# Altium project 一体机V5.PrjPcb (part 3 of 4)

## Sheet 02-GPRS.SchDoc
size A4; DocumentNumber: 18; SheetNumber: 18; SheetTotal: 34
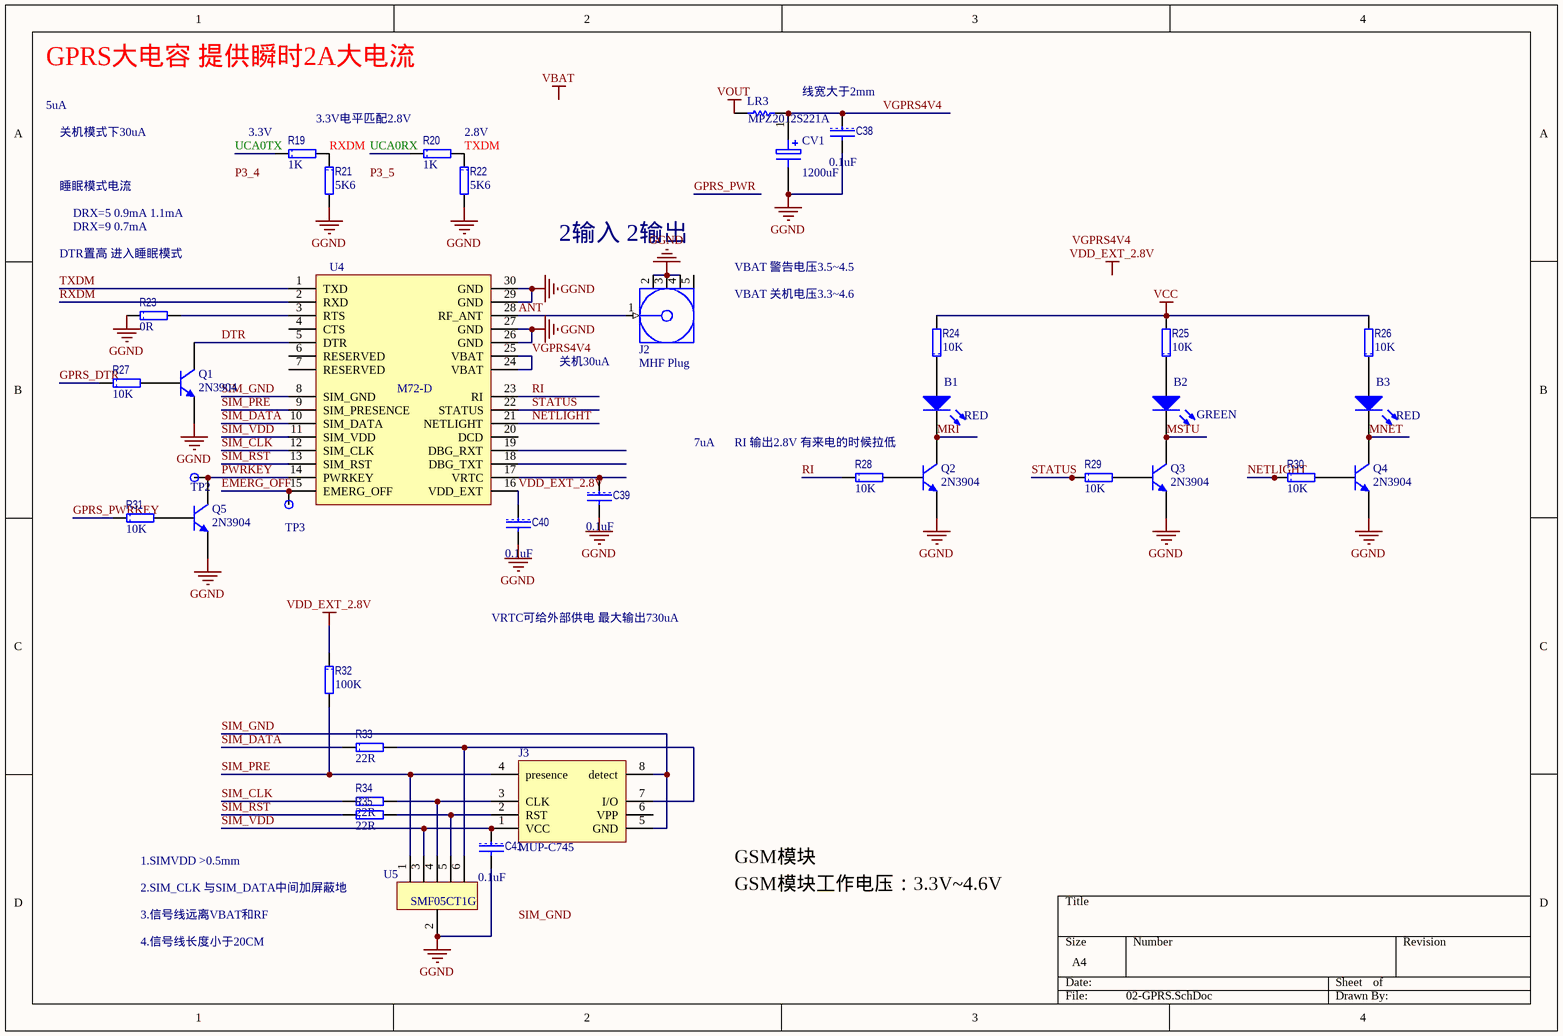
[diagram p18: 02-GPRS.SchDoc]

### Parts
B1  RED  [0805LED]
B2  GREEN  [0805LED]
B3  RED  [0805LED]
C38  value 0.1uF  [1608[0603]C]  (hidden comment: C1608X7R1H104K)
C39  value 0.1uF  [1608[0603]C]  (hidden comment: C1608X7R1H104K)
C40  value 0.1uF  [1608[0603]C]  (hidden comment: C1608X7R1H104K)
C41  value 0.1uF  [1608[0603]C]  (hidden comment: C1608X7R1H104K)
CV1  value 1200uF  [CAPPR5-10x20/H1.1]  (hidden comment: EEUFC1A122)
J2  MHF Plug  [MHF[MCB3]-V4]
J3  MUP-C745  [MUP-C745]
LR3  MPZ2012S221A  [2012[0805]]
Q1  2N3904  [SOT23_N]
Q2  2N3904  [SOT23_N]
Q3  2N3904  [SOT23_N]
Q4  2N3904  [SOT23_N]
Q5  2N3904  [SOT23_N]
R19  value 1K  [1608[0603]R]  (hidden comment: CRCW06031K00FKEA)
R20  value 1K  [1608[0603]R]  (hidden comment: CRCW06031K00FKEA)
R21  value 5K6  [1608[0603]R]  (hidden comment: CRCW060310K0FKEA)
R22  value 5K6  [1608[0603]R]  (hidden comment: CRCW060310K0FKEA)
R23  value 0R  [1608[0603]R]  (hidden comment: CRCW06030000ZSTA)
R24  value 10K  [1608[0603]R]  (hidden comment: CRCW060310K0FKEA)
R25  value 10K  [1608[0603]R]  (hidden comment: CRCW060310K0FKEA)
R26  value 10K  [1608[0603]R]  (hidden comment: CRCW060310K0FKEA)
R27  value 10K  [1608[0603]R]  (hidden comment: CRCW060310K0FKEA)
R28  value 10K  [1608[0603]R]  (hidden comment: CRCW060310K0FKEA)
R29  value 10K  [1608[0603]R]  (hidden comment: CRCW060310K0FKEA)
R30  value 10K  [1608[0603]R]  (hidden comment: CRCW060310K0FKEA)
R31  value 10K  [1608[0603]R]  (hidden comment: CRCW060310K0FKEA)
R32  value 100K  [1608[0603]R]  (hidden comment: CRCW0603100KFKEA)
R33  value 22R  [1608[0603]R]  (hidden comment: CRCW060322R0FKEA)
R34  value 22R  [1608[0603]R]  (hidden comment: CRCW060322R0FKEA)
R35  value 22R  [1608[0603]R]  (hidden comment: CRCW060322R0FKEA)
TP2  TP  [TP]  (value not drawn)
TP3  TP  [TP]  (value not drawn)
U4  M72-D  [M72D]
U5  SMF05CT1G  [SOT363-6N]

### Nets
GGND: C38.2 C39.2 C40.2 C41.2 CV1.2 J2.2(GND) J2.3(GND) J2.4(GND) Q1.1(E) Q2.1(E) Q3.1(E) Q4.1(E) Q5.1(E) R21.2 R22.2 R23.1 U4.26(GND) U4.27(GND) U4.29(GND) U4.30(GND) U5.2
VCC: R24.2 R25.2 R26.2
VDD_EXT_2.8V: C40.1 R32.1 U4.16(VDD_EXT)
VOUT: LR3.1
ANT: J2.1(Signal) U4.28(RF_ANT)
DTR: Q1.3(C) U4.5(DTR)
EMERG_OFF: TP3.1(TestPoint) U4.15(EMERG_OFF)
GPRS_DTR: R27.1
GPRS_PWRKEY: R31.1
MNET: B3.2(K) Q4.3(C)
MRI: B1.2(K) Q2.3(C)
MSTU: B2.2(K) Q3.3(C)
NETLIGHT: R30.1 U4.21(NETLIGHT)
PWRKEY: Q5.3(C) TP2.1(TestPoint) U4.14(PWRKEY)
RI: R28.1 U4.23(RI)
RXDM: R19.2 R21.1 U4.2(RXD)
SIM_CLK: R34.1 U4.12(SIM_CLK)
SIM_DATA: R33.1 U4.10(SIM_DATA)
SIM_GND: J3.5(GND) J3.8(detect) U4.8(SIM_GND)
SIM_PRE: J3.4(presence) R32.2 U4.9(SIM_PRESENCE) U5.1
SIM_RST: R35.1 U4.13(SIM_RST)
SIM_VDD: C41.1 J3.1(VCC) U4.11(SIM_VDD) U5.3
STATUS: R29.1 U4.22(STATUS)
TXDM: R20.2 R22.1 U4.1(TXD)
UCA0RX: R20.1  [project net P3_5]
UCA0TX: R19.1  [project net P3_4]
VGPRS4V4: C38.1 CV1.1 LR3.2 U4.24(VBAT) U4.25(VBAT)
NetB1_1: B1.1(A) R24.1
NetB2_1: B2.1(A) R25.1
NetB3_1: B3.1(A) R26.1
NetC39_1: C39.1 U4.17(VRTC)
NetJ3_2: J3.2(RST) R35.2 U5.5
NetJ3_3: J3.3(CLK) R34.2 U5.4
NetJ3_7: J3.7(I/O) R33.2 U5.6
NetQ1_2: Q1.2(B) R27.2
NetQ2_2: Q2.2(B) R28.2
NetQ3_2: Q3.2(B) R29.2
NetQ4_2: Q4.2(B) R30.2
NetQ5_2: Q5.2(B) R31.2
NetR23_2: R23.2 U4.3(RTS)

Not connected (* = marked no-connect by the designer): J2 5(GND); J3 6(VPP); U4 4(CTS) 6(RESERVED) 7(RESERVED) 18(DBG_TXT) 19(DBG_RXT) 20(DCD)

### Notes on the sheet
- 5uA
- GPRS大电容 提供瞬时2A大电流
- 线宽大于2mm
- 关机模式下30uA
- (near R19) 3.3V
- 3.3V电平匹配2.8V
- 2.8V
- 睡眠模式电流
- DRX=5 0.9mA 1.1mA
- DRX=9 0.7mA
- (near J2) 2输入 2输出
- DTR置高 进入睡眠模式
- (near J2) VBAT 警告电压3.5~4.5
- (near J2) VBAT 关机电压3.3~4.6
- 关机30uA
- 7uA
- (near R28) RI 输出2.8V 有来电的时候拉低
- VRTC可给外部供电 最大输出730uA
- 1.SIMVDD >0.5mm
- 2.SIM_CLK 与SIM_DATA中间加屏蔽地
- 3.信号线远离VBAT和RF
- GSM模块
- GSM模块工作电压：3.3V~4.6V
- 4.信号线长度小于20CM
- Labels drawn without touching a wire or pin: P3_4, P3_5, SIM_GND, VBAT, VDD_EXT_2.8V, VGPRS4V4

### Library data of the parts
B1-B3 = LED2: as B7 on sheet 03-指示灯; Published: 8-Jun-2000; LatestRevisionDate: 17-Jul-2002; LatestRevisionNote: Re-released for DXP Platform.; PackageVersion: Feb-2002; PackageReference: 3.2X1.6X1.1; Publisher: Altium Limited; PackageDescription: SM LED; 2 Flat Leads
C38-C41 = CAP: as C83 on sheet 电源ARM_LP5951_1.3; Category: 多层陶瓷电容器MLCC - SMD/SMT; ComponentLink1Description: http://www.tdk.com/pdf/general_B11.pdf; ComponentLink1URL: http://www.tdk.com/pdf/general_B11.pdf; Description 1: 多层陶瓷电容器MLCC - SMD/SMT 0603 0.1uF 50volts X7R 10%; Manufacturer Part Number: C1608X7R1H104K; Minimum Order Quantity: 1; Pricing 1: 1=0.160, 50=0.070, 100=0.036, 500=0.019, 1000=0.013, 4000=0.010, 8000=0.009, 12000=0.008, 20000=0.007 (USD); Reeling: True; RoHS - 贸泽: Y; RoHS: RoHS Compliant; Stock 1: 224604; Supplier 1: Mouser; Supplier Part Number 1: 810-C1608X7R1H104K; 制造商: TDK; 容差: 10 %; 温度系数/代码: X7R; 电容: 0.1 uF; 端接类型: SMD/SMT
CV1 = ELECTRO1: 插针 铝质电解电容器 - 带引线 1200uF 10V; Manufacturer: Panasonic Electronic Components; Manufacturer Part Number: EEU-FC1A122; 工作温度范围: - 55 C to + 105 C; 封装: Bulk; 产品: High Temp Electrolytic Capacitors; 系列: FC; 端接类型: Radial; 容差: 20 %; 外壳直径: 10 mm; 外壳长度: 20 mm; 引线间隔: 5 mm; 制造商: Panasonic; 产品种类: Radial Electrolytic Aluminum Capacitors; 标准包装数量: 200; Supplier 1: Mouser; Supplier Part Number 1: 667-EEU-FC1A122; RoHS: RoHS Compliant; Description 1: 铝质电解电容器 - 带引线 1200uF 10V; Category: 铝质电解电容器 - 带引线; Stock 1: 1597; Pricing 1: 1=0.330, 25=0.300, 100=0.275, 250=0.254, 500=0.250, 1000=0.241, 2000=0.230, 5000=0.214 (USD); 电容: 1200 uF; 电压额定值: 10 V; RoHS - 贸泽: Y; Minimum Order Quantity: 1; Reeling: False; ComponentLink1URL: http://www.mouser.com/ds/2/315/ABA0000CE22-7179.pdf; ComponentLink1Description: http://www.mouser.com/ds/2/315/ABA0000CE22-7179.pdf
J2 = COAX-F: 插针 RF 连接器 ONBRD IPEX MHF RECEPTACLE; Manufacturer: Taoglas; Manufacturer Part Number: RECE-20279-001E-01; 触点电镀: Gold; 型式: Receptacle (Female); 方向: Right Angle; 封装: Reel; 产品: Connectors; 端接类型: SMD/SMT; 触点材料: Brass; 射频系列: U.FL; Product Status: New at Mouser; Supplier 1: Mouser; Supplier Part Number 1: 960-RECE20279001E01; RoHS: RoHS Compliant; Description 1: RF 连接器 ONBRD IPEX MHF RECEPTACLE; Category: RF 连接器; Stock 1: 8300; Pricing 1: 1=0.900, 50=0.869, 100=0.833, 250=0.810, 500=0.756, 1000=0.698, 5000=0.698 (USD); 制造商: Taoglas; RoHS - 贸泽: Y; Minimum Order Quantity: 1; Reeling: True; ComponentLink1URL: http://www.taoglas.com/images/product_images/original_images/RECE.20279.001E-%20IPEX%20MHFI%20(U.FL)%20Receptacle.pdf; ComponentLink1Description: http://www.taoglas.com/images/product_images/original_images/RECE.20279.001E-%20IPEX%20MHFI%20(U.FL)%20Receptacle.pdf
J3 = SIMCARD: CON; 公司: MUP
LR3 = Res Semi: as LR14 on sheet 电源ARM_LP5951_1.3; Supplier 1: Mouser; Supplier Part Number 1: 810-MPZ2012S221A; Manufacturer Part Number: MPZ2012S221A; RoHS: RoHS Compliant; Description 1: 电磁干扰滤波珠子、扼流圈和阵列 Ferrite Chip Beads; Category: 电磁干扰滤波珠子、扼流圈和阵列; Stock 1: 26540; Pricing 1: 1=0.070, 50=0.060, 100=0.053, 500=0.040, 1000=0.035, 4000=0.031, 8000=0.029, 12000=0.025 (USD); 制造商: TDK; RoHS - 贸泽: Y; Minimum Order Quantity: 1; Reeling: True; ComponentLink1URL: http://www.mouser.com/ds/2/400/e9413_mpz-24582.pdf; ComponentLink1Description: http://www.mouser.com/ds/2/400/e9413_mpz-24582.pdf
Q1-Q5 = 2N3904: NPN General Purpose Amplifier; Published: 8-Jun-2000; LatestRevisionDate: 15-Jan-2003; LatestRevisionNote: PCB Footprint 'BCY-W3/D4.7' replaced; DatasheetVersion: 1997; PackageVersion: Sep-1998; PackageReference: TO-92A; Publisher: Altium Limited; PackageDescription: TO, Flat Index; 3 In-Line, Axial Leads; Body Dia. 4.5mm; Leads 0.51 x 0.48 mm (max); ComponentLink1Description: Manufacturer Link; ComponentLink1URL: http://www.fairchildsemi.com/; ComponentLink2Description: Datasheet; ComponentLink2URL: http://www.fairchildsemi.com/ds/2N%2F2N3904.pdf
R19 R20 = RES: as R77 on sheet 06-JTAG; Supplier 1: Mouser; Supplier Part Number 1: 71-CRCW0603-1.0K-E3; Manufacturer Part Number: CRCW06031K00FKEA; RoHS: RoHS Compliant By Exemption; Category: 厚膜电阻器 - SMD; Stock 1: 276938; Pricing 1: 1=0.080, 10=0.013, 100=0.010, 1000=0.008, 5000=0.005, 25000=0.004, 50000=0.003 (USD); 容差: 1 %; RoHS - 贸泽: E; Minimum Order Quantity: 1; Reeling: True; ComponentLink1URL: http://www.mouser.com/ds/2/427/dcrcwe3-109170.pdf; ComponentLink1Description: http://www.mouser.com/ds/2/427/dcrcwe3-109170.pdf; Description 1: 厚膜电阻器 - SMD 1/10watt 1.0Kohms 1%
R21 R22 R24-R31 = RES: as R72 on sheet 06-JTAG; Supplier 1: Mouser; Supplier Part Number 1: 71-CRCW0603-10K-E3; Manufacturer Part Number: CRCW060310K0FKEA; RoHS: RoHS Compliant By Exemption; Category: 厚膜电阻器 - SMD; Stock 1: 0; Pricing 1: 1=0.080, 10=0.013, 100=0.010, 1000=0.008, 5000=0.005, 25000=0.004, 50000=0.003 (USD); 电阻: 10 kOhms; 容差: 1 %; RoHS - 贸泽: E; Minimum Order Quantity: 1; Reeling: True; ComponentLink1URL: http://www.mouser.com/ds/2/427/dcrcwe3-109170.pdf; ComponentLink1Description: http://www.mouser.com/ds/2/427/dcrcwe3-109170.pdf; Description 1: 厚膜电阻器 - SMD 1/10watt 10Kohms 1%
R23 = RES: 厚膜电阻器 - SMD 1/10watt ZEROohm Jumper; Manufacturer: Vishay / Dale; 尺寸: 0.85 mm W x 1.55 mm L x 0.45 mm H; 工作温度范围: - 55 C to + 155 C; 封装 / 箱体: 0603 (1608 metric); 封装: Reel; 功率额定值: 100 mW; 产品: Thick Film Resistors Zero-Ohm; 电阻: 0 Ohms; 系列: CRCW; 温度系数: 200 PPM / C; 端接类型: SMD/SMT; 容差: 1 %; 电压额定值: 75 V; 外壳代码 - in: 0603; 外壳代码 - mm: 1608; 制造商: Vishay; 产品种类: 0603 Thick Film Chip Resistors; 标准包装数量: 5000; Supplier 1: Mouser; Supplier Part Number 1: 71-CRCW0603-0; Manufacturer Part Number: CRCW06030000ZSTA; RoHS: No; Category: 厚膜电阻器 - SMD; Stock 1: 44945; Pricing 1: 1=0.110, 10=0.064, 100=0.036, 1000=0.024, 5000=0.010, 10000=0.009, 25000=0.008, 50000=0.006 (USD); RoHS - 贸泽: N; Minimum Order Quantity: 1; Reeling: True; ComponentLink1URL: http://www.mouser.com/ds/2/427/dcrcw-72725.pdf; ComponentLink1Description: http://www.mouser.com/ds/2/427/dcrcw-72725.pdf; Description 1: 厚膜电阻器 - SMD 1/10watt ZEROohm Jumper
R32 = RES: 厚膜电阻器 - SMD 1/10watt 100Kohms 1%; Manufacturer: Vishay / Dale; 尺寸: 0.85 mm W x 1.55 mm L x 0.45 mm H; 工作温度范围: - 55 C to + 155 C; 封装 / 箱体: 0603 (1608 metric); 封装: Reel; 功率额定值: 100 mW; 产品: Thick Film Resistors SMD; 系列: CRCW; 温度系数: 100 PPM / K; 端接类型: SMD/SMT; 电压额定值: 75 V; 制造商: Vishay; 产品种类: 0603 Thick Film Chip Resistors; 标准包装数量: 5000; 外壳代码 - in: 0603; 外壳代码 - mm: 1608; Supplier 1: Mouser; Supplier Part Number 1: 71-CRCW0603-100K-E3; Manufacturer Part Number: CRCW0603100KFKEA; RoHS: RoHS Compliant By Exemption; Category: 厚膜电阻器 - SMD; Stock 1: 175756; Pricing 1: 1=0.080, 10=0.013, 100=0.010, 1000=0.008, 5000=0.005, 25000=0.004, 50000=0.003 (USD); 电阻: 100 kOhms; 容差: 1 %; RoHS - 贸泽: E; Minimum Order Quantity: 1; Reeling: True; ComponentLink1URL: http://www.mouser.com/ds/2/427/dcrcwe3-109170.pdf; ComponentLink1Description: http://www.mouser.com/ds/2/427/dcrcwe3-109170.pdf; Description 1: 厚膜电阻器 - SMD 1/10watt 100Kohms 1%
R33-R35 = RES: as R96 on sheet 12-LCD背光驱动_BIT3251; Supplier 1: Mouser; Supplier Part Number 1: 71-CRCW0603-22-E3; Manufacturer Part Number: CRCW060322R0FKEA; RoHS: RoHS Compliant By Exemption; Category: 厚膜电阻器 - SMD; Stock 1: 35802; 电阻: 22 Ohms; 容差: 1 %; Minimum Order Quantity: 1; Reeling: True; ComponentLink1URL: http://www.mouser.com/ds/2/427/dcrcwe3-109170.pdf; ComponentLink1Description: http://www.mouser.com/ds/2/427/dcrcwe3-109170.pdf; Description 1: 厚膜电阻器 - SMD 1/10watt 22ohms 1%; Pricing 1: 1=0.080, 10=0.013, 100=0.010, 1000=0.008, 5000=0.005, 25000=0.004, 50000=0.003 (USD); RoHS - 贸泽: E
TP2 TP3 = Test Point
U4 = M72-D: GSM模块; 公司: 上海移远
U5 = SMF05CT1G: TVS二极管阵列 5 Line TVS Array; Manufacturer: ON Semiconductor; 击穿电压: 6.2 V; 电容: 80 pF; 钳位电压: 12.5 V; 尺寸: 1.25 mm W x 2 mm L; 工作电压: 5 V; 封装 / 箱体: SC-70-6; 封装: Reel; 系列: SMFxxCT1G; 端接类型: SMD/SMT; 通道: 5 Channels; 峰值浪涌电流: 8 A; 最大工作温度: + 125 C; 最小工作温度: - 40 C; 峰值脉冲功率耗散: 100 W; 极性: Unidirectional; 产品种类: Diodes- Zener; 标准包装数量: 3000; Supplier 1: Mouser; Supplier Part Number 1: 863-SMF05CT1G; Manufacturer Part Number: SMF05CT1G; RoHS: RoHS Compliant; Description 1: TVS二极管阵列 5 Line TVS Array; Category: TVS二极管阵列; Stock 1: 6019; Pricing 1: 1=0.330, 25=0.285, 100=0.187, 500=0.155, 1000=0.116, 2000=0.107, 3000=0.107, 5000=0.100, 10000=0.093, 25000=0.086 (USD); 安装风格: SMD/SMT; 制造商: ON Semiconductor; RoHS - 贸泽: Y; Minimum Order Quantity: 1; Reeling: True; ComponentLink1URL: http://www.mouser.com/ds/2/308/SMF05C-D-100912.pdf; ComponentLink1Description: http://www.mouser.com/ds/2/308/SMF05C-D-100912.pdf

## Sheet 03-GPS.SchDoc
size A4; DocumentNumber: 19; SheetNumber: 19; SheetTotal: 34
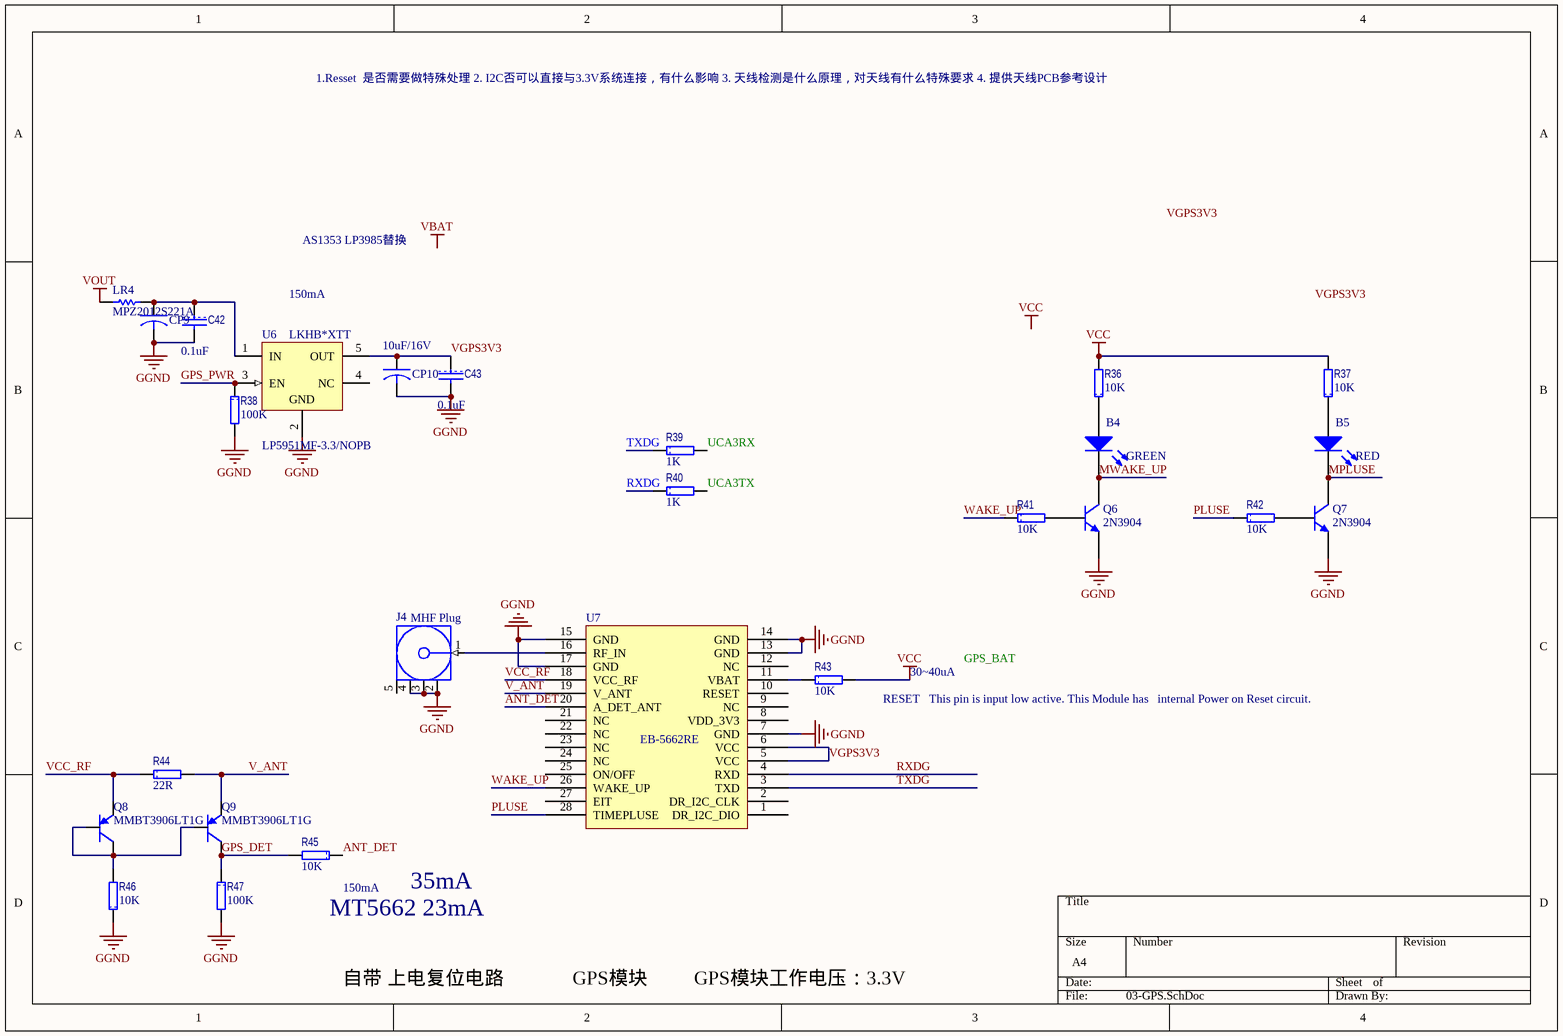
[diagram p19: 03-GPS.SchDoc]

### Parts
B4  GREEN  [0805LED]
B5  RED  [0805LED]
C42  value 0.1uF  [1608[0603]C]  (hidden comment: C1608X7R1H104K)
C43  value 0.1uF  [1608[0603]C]  (hidden comment: C1608X7R1H104K)
CP9  TAJA106K016RNJ  [3216[1206]CB]  (value not drawn)
CP10  value 10uF/16V  [3216[1206]CB]  (hidden comment: TAJA106K016RNJ)
J4  MHF Plug  [MHF[MCB3]-V4]
LR4  MPZ2012S221A  [2012[0805]]
Q6  2N3904  [SOT23_N]
Q7  2N3904  [SOT23_N]
Q8  MMBT3906LT1G  [SOT23_N]
Q9  MMBT3906LT1G  [SOT23_N]
R36  value 10K  [1608[0603]R]  (hidden comment: CRCW060310K0FKEA)
R37  value 10K  [1608[0603]R]  (hidden comment: CRCW060310K0FKEA)
R38  value 100K  [1608[0603]R]  (hidden comment: CRCW0603100KFKEA)
R39  value 1K  [1608[0603]R]  (hidden comment: CRCW06031K00FKEA)
R40  value 1K  [1608[0603]R]  (hidden comment: CRCW06031K00FKEA)
R41  value 10K  [1608[0603]R]  (hidden comment: CRCW060310K0FKEA)
R42  value 10K  [1608[0603]R]  (hidden comment: CRCW060310K0FKEA)
R43  value 10K  [1608[0603]R]  (hidden comment: CRCW060310K0FKEA)
R44  value 22R  [1608[0603]R]  (hidden comment: CRCW060322R0FKEA)
R45  value 10K  [1608[0603]R]  (hidden comment: CRCW060310K0FKEA)
R46  value 10K  [1608[0603]R]  (hidden comment: CRCW060310K0FKEA)
R47  value 100K  [1608[0603]R]  (hidden comment: CRCW0603100KFKEA)
U6  LP5951MF-3.3/NOPB  PackageTopMarking: LKHB*XTT  [MF05A_N]
U7  EB-5662RE  [EB-5662RE]

### Nets
GGND: C42.2 C43.2 CP9.2 CP10.2 J4.2(GND) J4.3(GND) J4.4(GND) Q6.1(E) Q7.1(E) R38.2 R46.1 R47.2 U6.2(GND) U7.7(GND) U7.13(GND) U7.14(GND) U7.15(GND) U7.17(GND)
VCC: R36.2 R37.2 R43.2
VOUT: LR4.1
ANT_DET: R45.1 U7.20(A_DET_ANT)
GPS_DET: Q9.3 R45.2 R47.1
GPS_PWR: R38.1 U6.3(EN)
MPLUSE: B5.2(K) Q7.3(C)
MWAKE_UP: B4.2(K) Q6.3(C)
PLUSE: R42.1 U7.28(TIMEPLUSE)
RXDG: R40.1 U7.4(RXD)
TXDG: R39.1 U7.3(TXD)
UCA3RX: R39.2  [project net P10_5]
UCA3TX: R40.2  [project net P10_4]
V_ANT: Q9.2 R44.2 U7.19(V_ANT)
VCC_RF: Q8.2 R44.1 U7.18(VCC_RF)
VGPS3V3: C43.1 CP10.1 U6.5(OUT) U7.5(VCC) U7.6(VCC)
WAKE_UP: R41.1 U7.26(WAKE_UP)
NetB4_1: B4.1(A) R36.1
NetB5_1: B5.1(A) R37.1
NetC42_1: C42.1 CP9.1 LR4.2 U6.1(IN)
NetJ4_1: J4.1(Signal) U7.16(RF_IN)
NetQ6_2: Q6.2(B) R41.2
NetQ7_2: Q7.2(B) R42.2
NetQ8_1: Q8.1 Q8.3 Q9.1 R46.2
NetR43_1: R43.1 U7.11(VBAT)

Not connected (* = marked no-connect by the designer): J4 5(GND); U6 4(NC); U7 1(DR_I2C_DIO) 2(DR_I2C_CLK) 8(VDD_3V3) 9(NC) 10(RESET) 12(NC) 21(NC) 22(NC) 23(NC) 24(NC) 25(ON/OFF) 27(EIT)

### Notes on the sheet
- 1.Resset  是否需要做特殊处理 2. I2C否可以直接与3.3V系统连接，有什么影响 3. 天线检测是什么原理，对天线有什么特殊要求 4. 提供天线PCB参考设计
- AS1353 LP3985替换
- 150mA
- (near R43) RESET   This pin is input low active. This Module has   internal Power on Reset circuit.
- 30~40uA
- (near R45) MT5662 23mA
- (near R45) 150mA
- 35mA
- 自带 上电复位电路
- GPS模块
- GPS模块工作电压：3.3V
- Labels drawn without touching a wire or pin: GPS_BAT, VBAT, VCC, VGPS3V3

### Library data of the parts
B4 B5 = LED2: Typical RED, GREEN, YELLOW, AMBER GaAs LED; Published: 8-Jun-2000; LatestRevisionDate: 17-Jul-2002; LatestRevisionNote: Re-released for DXP Platform.; PackageVersion: Feb-2002; PackageReference: 3.2X1.6X1.1; Publisher: Altium Limited; PackageDescription: SM LED; 2 Flat Leads
C42 C43 = CAP: 多层陶瓷电容器MLCC - SMD/SMT 0603 0.1uF 50volts X7R 10%; Manufacturer: TDK; 产品: General Type MLCCs; 产品种类: Low & Medium Capacitance SMD Ceramic Chip Capacitors; 外壳代码 - in: 0603; 外壳代码 - mm: 1608; 封装 / 箱体: 0603 (1608 metric); 封装: Reel; 尺寸: 0.8 mm W x 1.6 mm L x 0.8 mm H; 工作温度范围: - 55 C to + 125 C; 标准包装数量: 4000; 电压额定值: 50 V; 电容-nF: 100 nF; 电容-pF: 100000 pF; 系列: C; Category: 多层陶瓷电容器MLCC - SMD/SMT; ComponentLink1Description: http://www.tdk.com/pdf/general_B11.pdf; ComponentLink1URL: http://www.tdk.com/pdf/general_B11.pdf; Description 1: 多层陶瓷电容器MLCC - SMD/SMT 0603 0.1uF 50volts X7R 10%; Manufacturer Part Number: C1608X7R1H104K; Minimum Order Quantity: 1; Pricing 1: 1=0.160, 50=0.070, 100=0.036, 500=0.019, 1000=0.013, 4000=0.010, 8000=0.009, 12000=0.008, 20000=0.007 (USD); Reeling: True; RoHS - 贸泽: Y; RoHS: RoHS Compliant; Stock 1: 224604; Supplier 1: Mouser; Supplier Part Number 1: 810-C1608X7R1H104K; 制造商: TDK; 容差: 10 %; 温度系数/代码: X7R; 电容: 0.1 uF; 端接类型: SMD/SMT
CP9 CP10 = CAPACITOR: 钽质电容器-固体SMD 16volts 10uF 10%; Manufacturer: AVX; ESR: 3 Ohms; 产品: Tantalum Solid Standard Grade - Other Various; 产品种类: SMD Tantalum Capacitors; 制造商库存号: A Case; 外壳代码 - in: 1206; 外壳代码 - mm: 3216; 封装 / 箱体: 1206 (3216 metric); 封装: Reel; 尺寸: 1.6 mm W x 3.2 mm L; 工作温度范围: - 55 C to + 125 C; 损耗因数 DF: 8; 标准包装数量: 2000; 漏泄电流: 1.6 uA; 电压额定值: 16 V; 端接类型: SMD/SMT; 系列: TAJ; 高度: 1.8 mm; Category: 钽质电容器-固体SMD; ComponentLink1Description: http://www.avx.com/docs/Catalogs/taj.pdf; ComponentLink1URL: http://www.avx.com/docs/Catalogs/taj.pdf; Description 1: 钽质电容器-固体SMD 16volts 10uF 10%; Manufacturer Part Number: TAJA106K016RNJ; Minimum Order Quantity: 1; Pricing 1: 1=0.600, 100=0.280, 200=0.250, 500=0.221, 1000=0.200, 2000=0.140, 5000=0.131, 10000=0.124, 25000=0.103 (USD); Reeling: True; RoHS - 贸泽: Y; RoHS: RoHS Compliant; Stock 1: 20335; Supplier 1: Mouser; Supplier Part Number 1: 581-TAJA106K016R; 制造商: AVX; 容差: 10 %; 电容: 10 uF
J4 = COAX-F: 插针 RF 连接器 ONBRD IPEX MHF RECEPTACLE; Manufacturer: Taoglas; Manufacturer Part Number: RECE-20279-001E-01; 触点电镀: Gold; 型式: Receptacle (Female); 方向: Right Angle; 封装: Reel; 产品: Connectors; 端接类型: SMD/SMT; 触点材料: Brass; 射频系列: U.FL; Product Status: New at Mouser; Supplier 1: Mouser; Supplier Part Number 1: 960-RECE20279001E01; RoHS: RoHS Compliant; Description 1: RF 连接器 ONBRD IPEX MHF RECEPTACLE; Category: RF 连接器; Stock 1: 8300; Pricing 1: 1=0.900, 50=0.869, 100=0.833, 250=0.810, 500=0.756, 1000=0.698, 5000=0.698 (USD); 制造商: Taoglas; RoHS - 贸泽: Y; Minimum Order Quantity: 1; Reeling: True; ComponentLink1URL: http://www.taoglas.com/images/product_images/original_images/RECE.20279.001E-%20IPEX%20MHFI%20(U.FL)%20Receptacle.pdf; ComponentLink1Description: http://www.taoglas.com/images/product_images/original_images/RECE.20279.001E-%20IPEX%20MHFI%20(U.FL)%20Receptacle.pdf
LR4 = Res Semi: 电磁干扰滤波珠子、扼流圈和阵列 Ferrite Chip Beads; Manufacturer: TDK; 阻抗: 220 Ohms; 最大直流电流: 3 A; 最大直流电阻: 0.04 Ohms; 工作温度范围: - 55 C to + 125 C; 封装 / 箱体: 2012; 封装: Reel; 端接类型: SMD/SMT; 容差: 25 %; 产品种类: Ferrite Beads; 标准包装数量: 4000; Supplier 1: Mouser; Supplier Part Number 1: 810-MPZ2012S221A; Manufacturer Part Number: MPZ2012S221A; RoHS: RoHS Compliant; Description 1: 电磁干扰滤波珠子、扼流圈和阵列 Ferrite Chip Beads; Category: 电磁干扰滤波珠子、扼流圈和阵列; Stock 1: 26540; Pricing 1: 1=0.070, 50=0.060, 100=0.053, 500=0.040, 1000=0.035, 4000=0.031, 8000=0.029, 12000=0.025 (USD); 制造商: TDK; RoHS - 贸泽: Y; Minimum Order Quantity: 1; Reeling: True; ComponentLink1URL: http://www.mouser.com/ds/2/400/e9413_mpz-24582.pdf; ComponentLink1Description: http://www.mouser.com/ds/2/400/e9413_mpz-24582.pdf
Q6 Q7 = 2N3904: NPN General Purpose Amplifier; Published: 8-Jun-2000; LatestRevisionDate: 15-Jan-2003; LatestRevisionNote: PCB Footprint 'BCY-W3/D4.7' replaced; DatasheetVersion: 1997; PackageVersion: Sep-1998; PackageReference: TO-92A; Publisher: Altium Limited; PackageDescription: TO, Flat Index; 3 In-Line, Axial Leads; Body Dia. 4.5mm; Leads 0.51 x 0.48 mm (max); ComponentLink1Description: Manufacturer Link; ComponentLink1URL: http://www.fairchildsemi.com/; ComponentLink2Description: Datasheet; ComponentLink2URL: http://www.fairchildsemi.com/ds/2N%2F2N3904.pdf
Q8 Q9 = MMBT3096: 两极晶体管 - BJT 200mA 40V PNP; Manufacturer: ON Semiconductor; 集电极—基极电压 VCBO: - 40 V; 配置: Single; 发射极 - 基极电压 VEBO: 5 V; 封装 / 箱体: SOT-23-3; 封装: Reel; 集电极—射极饱和电压: - 0.4 V; 集电极连续电流: - 0.2 A; 安装风格: SMD/SMT; 直流集电极/Base Gain hfe Min: 60 at 0.1 mA at 1 V; 增益带宽产品fT: 250 MHz; 最大直流电集电极电流: 0.2 A; 最大工作温度: + 150 C; 最大功率耗散: 225 mW; 最小工作温度: - 55 C; 产品种类: Transistors Bipolar- General Purpose; 标准包装数量: 3000; Supplier 1: Mouser; Supplier Part Number 1: 863-MMBT3906LT1G; Manufacturer Part Number: MMBT3906LT1G; RoHS: RoHS Compliant; Description 1: 两极晶体管 - BJT 200mA 40V PNP; Category: 两极晶体管 - BJT; Stock 1: 32950; Pricing 1: 1=0.110, 25=0.099, 100=0.042, 500=0.034, 1000=0.024, 2000=0.020, 3000=0.020, 5000=0.018, 10000=0.015, 25000=0.014 (USD); 集电极—发射极最大电压 VCEO: - 40 V; 晶体管极性: PNP; 制造商: ON Semiconductor; RoHS - 贸泽: Y; Minimum Order Quantity: 1; Reeling: True; ComponentLink1URL: http://www.mouser.com/ds/2/308/MMBT3906LT1-D-112192.pdf; ComponentLink1Description: http://www.mouser.com/ds/2/308/MMBT3906LT1-D-112192.pdf
R36 R37 R41-R43 R45 R46 = RES: 厚膜电阻器 - SMD 1/10watt 10Kohms 1%; Manufacturer: Vishay / Dale; 尺寸: 0.85 mm W x 1.55 mm L x 0.45 mm H; 工作温度范围: - 55 C to + 155 C; 封装 / 箱体: 0603 (1608 metric); 封装: Reel; 功率额定值: 100 mW; 产品: Thick Film Resistors SMD; 系列: CRCW; 温度系数: 100 PPM / K; 端接类型: SMD/SMT; 电压额定值: 75 V; 制造商: Vishay; 产品种类: 0603 Thick Film Chip Resistors; 标准包装数量: 5000; 外壳代码 - in: 0603; 外壳代码 - mm: 1608; Supplier 1: Mouser; Supplier Part Number 1: 71-CRCW0603-10K-E3; Manufacturer Part Number: CRCW060310K0FKEA; RoHS: RoHS Compliant By Exemption; Category: 厚膜电阻器 - SMD; Stock 1: 0; Pricing 1: 1=0.080, 10=0.013, 100=0.010, 1000=0.008, 5000=0.005, 25000=0.004, 50000=0.003 (USD); 电阻: 10 kOhms; 容差: 1 %; RoHS - 贸泽: E; Minimum Order Quantity: 1; Reeling: True; ComponentLink1URL: http://www.mouser.com/ds/2/427/dcrcwe3-109170.pdf; ComponentLink1Description: http://www.mouser.com/ds/2/427/dcrcwe3-109170.pdf; Description 1: 厚膜电阻器 - SMD 1/10watt 10Kohms 1%
R38 R47 = RES: 厚膜电阻器 - SMD 1/10watt 100Kohms 1%; Manufacturer: Vishay / Dale; 尺寸: 0.85 mm W x 1.55 mm L x 0.45 mm H; 工作温度范围: - 55 C to + 155 C; 封装 / 箱体: 0603 (1608 metric); 封装: Reel; 功率额定值: 100 mW; 产品: Thick Film Resistors SMD; 系列: CRCW; 温度系数: 100 PPM / K; 端接类型: SMD/SMT; 电压额定值: 75 V; 制造商: Vishay; 产品种类: 0603 Thick Film Chip Resistors; 标准包装数量: 5000; 外壳代码 - in: 0603; 外壳代码 - mm: 1608; Supplier 1: Mouser; Supplier Part Number 1: 71-CRCW0603-100K-E3; Manufacturer Part Number: CRCW0603100KFKEA; RoHS: RoHS Compliant By Exemption; Category: 厚膜电阻器 - SMD; Stock 1: 175756; Pricing 1: 1=0.080, 10=0.013, 100=0.010, 1000=0.008, 5000=0.005, 25000=0.004, 50000=0.003 (USD); 电阻: 100 kOhms; 容差: 1 %; RoHS - 贸泽: E; Minimum Order Quantity: 1; Reeling: True; ComponentLink1URL: http://www.mouser.com/ds/2/427/dcrcwe3-109170.pdf; ComponentLink1Description: http://www.mouser.com/ds/2/427/dcrcwe3-109170.pdf; Description 1: 厚膜电阻器 - SMD 1/10watt 100Kohms 1%
R39 R40 = RES: 厚膜电阻器 - SMD 1/10watt 1.0Kohms 1%; Manufacturer: Vishay / Dale; 尺寸: 0.85 mm W x 1.55 mm L x 0.45 mm H; 工作温度范围: - 55 C to + 155 C; 封装 / 箱体: 0603 (1608 metric); 封装: Reel; 功率额定值: 100 mW; 产品: Thick Film Resistors SMD; 电阻: 1 kOhms; 系列: CRCW; 温度系数: 100 PPM / K; 端接类型: SMD/SMT; 电压额定值: 75 V; 制造商: Vishay; 产品种类: 0603 Thick Film Chip Resistors; 标准包装数量: 5000; 外壳代码 - in: 0603; 外壳代码 - mm: 1608; Supplier 1: Mouser; Supplier Part Number 1: 71-CRCW0603-1.0K-E3; Manufacturer Part Number: CRCW06031K00FKEA; RoHS: RoHS Compliant By Exemption; Category: 厚膜电阻器 - SMD; Stock 1: 276938; Pricing 1: 1=0.080, 10=0.013, 100=0.010, 1000=0.008, 5000=0.005, 25000=0.004, 50000=0.003 (USD); 容差: 1 %; RoHS - 贸泽: E; Minimum Order Quantity: 1; Reeling: True; ComponentLink1URL: http://www.mouser.com/ds/2/427/dcrcwe3-109170.pdf; ComponentLink1Description: http://www.mouser.com/ds/2/427/dcrcwe3-109170.pdf; Description 1: 厚膜电阻器 - SMD 1/10watt 1.0Kohms 1%
R44 = RES: 厚膜电阻器 - SMD 1/10watt 22ohms 1%; Manufacturer: Vishay / Dale; 尺寸: 0.85 mm W x 1.55 mm L x 0.45 mm H; 工作温度范围: - 55 C to + 155 C; 封装 / 箱体: 0603 (1608 metric); 封装: Reel; 功率额定值: 100 mW; 产品: Thick Film Resistors SMD; 系列: CRCW; 温度系数: 100 PPM / K; 端接类型: SMD/SMT; 电压额定值: 75 V; 制造商: Vishay; 标准包装数量: 5000; 外壳代码 - in: 0603; 外壳代码 - mm: 1608; 产品种类: 0603 Thick Film Chip Resistors; Supplier 1: Mouser; Supplier Part Number 1: 71-CRCW0603-22-E3; Manufacturer Part Number: CRCW060322R0FKEA; RoHS: RoHS Compliant By Exemption; Category: 厚膜电阻器 - SMD; Stock 1: 35802; 电阻: 22 Ohms; 容差: 1 %; Minimum Order Quantity: 1; Reeling: True; ComponentLink1URL: http://www.mouser.com/ds/2/427/dcrcwe3-109170.pdf; ComponentLink1Description: http://www.mouser.com/ds/2/427/dcrcwe3-109170.pdf; Description 1: 厚膜电阻器 - SMD 1/10watt 22ohms 1%; Pricing 1: 1=0.080, 10=0.013, 100=0.010, 1000=0.008, 5000=0.005, 25000=0.004, 50000=0.003 (USD); RoHS - 贸泽: E
U6 = LP5951MF-3.3/NOPB: Micropower, 150mA Low-Dropout CMOS Voltage Regulator, 5-pin SOT-23, Pb-Free; Manufacturer: National Semiconductor; PowerWise: N; CompType: LDO IC; Published: 1-Mar-2010; DatasheetVersion: May-2007; PackageVersion: revD, Aug-2008; PackageReference: MF05A; Publisher: Altium Limited; PackageDescription: Molded SOT-23, .115 x .063 x .040 in Body, 5 Lead, .0375 in Pitch; Supplier 1: Digi-Key; Supplier Part Number 1: LP5951MF-3.3TR-ND; Supplier 2: Digi-Key; Supplier Part Number 2: LP5951MF-3.3CT-ND; Supplier 3: Digi-Key; Supplier Part Number 3: LP5951MF-3.3DKR-ND; Supplier 4: Farnell; Supplier Part Number 4: 1559259; PartNumber: LP5951MF-3.3/NOPB; RoHS: Y; PinCount: 5; ComponentLink1Description: LP5951 Datasheet; ComponentLink1URL: http://www.national.com/ds/LP/LP5951.pdf; ComponentLink2Description: LP5951 Web Page; ComponentLink2URL: http://www.national.com/pf/LP/LP5951.html; ComponentLink3Description: MF05A Package Page; ComponentLink3URL: http://www.national.com/packaging/folders/mf05a.html
U7 = EB-5662RE: GPS模块; 公司: Globalsat

## Sheet BQ24073_锂电池充电.SchDoc
size A4; DocumentNumber: 16; SheetNumber: 16; SheetTotal: 34
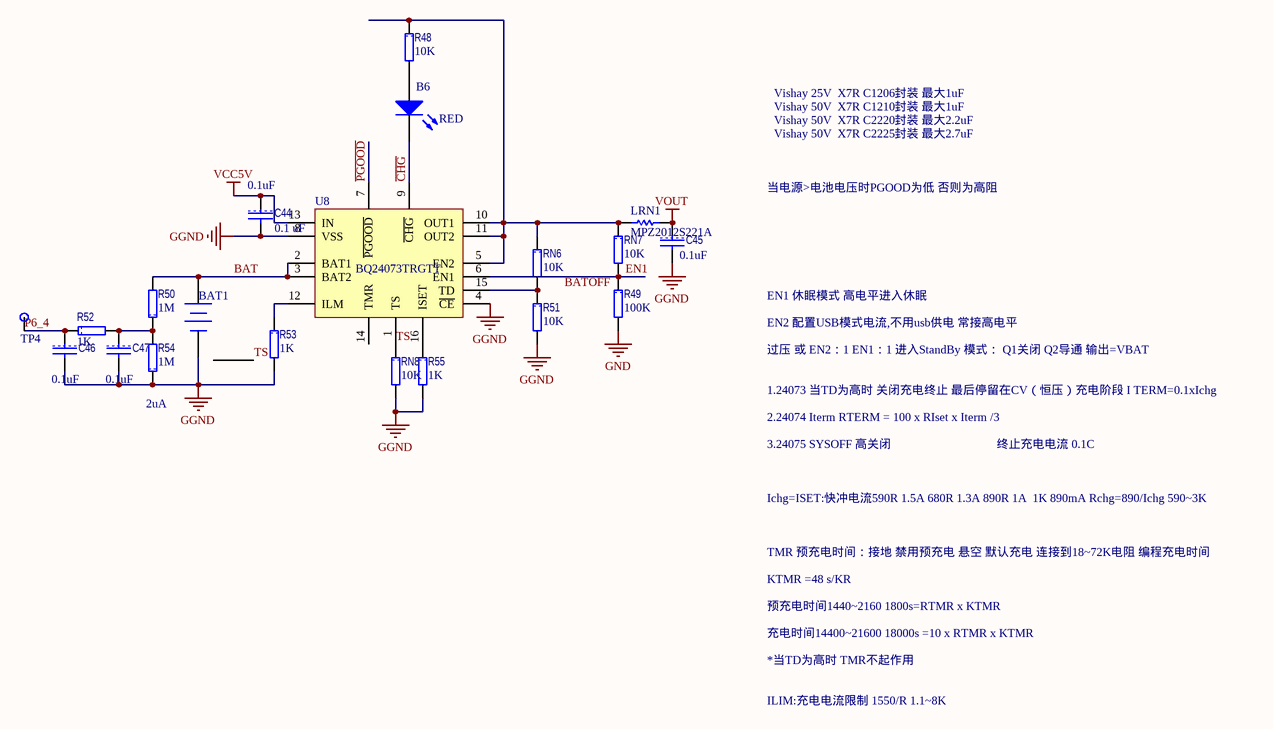
[diagram p20: BQ24073_锂电池充电.SchDoc]

### Parts
B6  RED  [0805LED]
BAT1  18650/5000mAH/3.7V  [BAT_3]  (value not drawn)
C44  value 0.1uF  电容: 0.1 uF  [1608[0603]C]  (hidden comment: C1608X7R1H104K)
C45  value 0.1uF  [1608[0603]C]  (hidden comment: C1608X7R1H104K)
C46  value 0.1uF  [1608[0603]C]  (hidden comment: C1608X7R1H104K)
C47  value 0.1uF  [1608[0603]C]  (hidden comment: C1608X7R1H104K)
LRN1  MPZ2012S221A  [2012[0805]]
R48  value 10K  [1608[0603]R]  (hidden comment: CRCW060310K0FKEA)
R49  value 100K  [1608[0603]R]  (hidden comment: CRCW0603100KFKEA)
R50  value 1M  [1608[0603]R]  (hidden comment: CRCW06031M00FKEA)
R51  value 10K  [1608[0603]R]  (hidden comment: CRCW060310K0FKEA)
R52  value 1K  [1608[0603]R]  (hidden comment: CRCW06031K00FKEA)
R53  value 1K  [1608[0603]R]  (hidden comment: CRCW06031K00FKEA)
R54  value 1M  [1608[0603]R]  (hidden comment: CRCW06031M00FKEA)
R55  value 1K  [1608[0603]R]  (hidden comment: CRCW06031K00FKEA)
RN6  value 10K  [1608[0603]RN]  (hidden comment: CRCW060310K0FKEA)
RN7  value 10K  [1608[0603]RN]  (hidden comment: CRCW060310K0FKEA)
RN8  value 10K  [1608[0603]RN]  (hidden comment: CRCW060310K0FKEA)
TP4  TP  [TP]  (value not drawn)
U8  BQ24073TRGTT  [BQ24073]

### Nets
GGND: BAT1.2(-) C44.2 C45.2 C46.2 C47.2 R51.2 R53.2 R54.1 R55.2 RN8.2 U8.4(~{CE}) U8.8(VSS)
GND: R49.2
VCC5V: C44.1 U8.13(IN)
VOUT: C45.1 LRN1.2
BAT: BAT1.1(+) R50.2 U8.2(BAT1) U8.3(BAT2)
~{CHG}: B6.2(K) U8.9(~{CHG})
EN1: R49.1 RN7.2 U8.6(EN1)
P6_4: C46.1 R52.1 TP4.1(TestPoint)
~{PGOOD}: U8.7(~{PGOOD})
TS: BAT1.3(TS) RN8.1 U8.1(TS)
NetB6_1: B6.1(A) R48.2
NetC47_1: C47.1 R50.1 R52.2 R54.2
NetLRN1_1: LRN1.1 R48.1 RN6.1 RN7.1 U8.5(EN2) U8.10(OUT1) U8.11(OUT2)
NetR51_1: R51.1 RN6.2 U8.15(TD)
NetR53_1: R53.1 U8.12(ILM)
NetR55_1: R55.1 U8.16(ISET)

Not connected (* = marked no-connect by the designer): U8 14(TMR)

### Notes on the sheet
- Vishay 25V  X7R C1206封装 最大1uF
- Vishay 50V  X7R C2225封装 最大2.7uF
- Vishay 50V  X7R C2220封装 最大2.2uF
- Vishay 50V  X7R C1210封装 最大1uF
- 当电源>电池电压时PGOOD为低 否则为高阻
- EN1 休眠模式 高电平进入休眠
- 过压 或 EN2：1 EN1：1 进入StandBy 模式： Q1关闭 Q2导通 输出=VBAT
- EN2 配置USB模式电流,不用usb供电 常接高电平
- (near R54) 2uA
- 1.24073 当TD为高时 关闭充电终止 最后停留在CV（恒压）充电阶段 I TERM=0.1xIchg
- 2.24074 Iterm RTERM = 100 x RIset x Iterm /3
- Ichg=ISET:快冲电流590R 1.5A 680R 1.3A 890R 1A  1K 890mA Rchg=890/Ichg 590~3K
- 3.24075 SYSOFF 高关闭
- 终止充电电流 0.1C
- TMR 预充电时间：接地 禁用预充电 悬空 默认充电 连接到18~72K电阻 编程充电时间
- KTMR =48 s/KR
- 预充电时间1440~2160 1800s=RTMR x KTMR
- 充电时间14400~21600 18000s =10 x RTMR x KTMR
- ILIM:充电电流限制 1550/R 1.1~8K
- *当TD为高时 TMR不起作用
- Labels drawn without touching a wire or pin: BATOFF

### Library data of the parts
B6 = LED2: as B4 on sheet 03-GPS; Published: 8-Jun-2000; LatestRevisionDate: 17-Jul-2002; LatestRevisionNote: Re-released for DXP Platform.; PackageVersion: Feb-2002; PackageReference: 3.2X1.6X1.1; Publisher: Altium Limited; PackageDescription: SM LED; 2 Flat Leads
BAT1 = Battery: 插针 Multicell Battery
C44 C45 = CAP: 多层陶瓷电容器MLCC - SMD/SMT 0603 0.1uF 50volts X7R 10%; Manufacturer: TDK; 尺寸: 0.8 mm W x 1.6 mm L x 0.8 mm H; 工作温度范围: - 55 C to + 125 C; 封装 / 箱体: 0603 (1608 metric); 封装: Reel; 产品: General Type MLCCs; 系列: C; 电压额定值: 50 V; 电容-nF: 100 nF; 电容-pF: 100000 pF; 外壳代码 - in: 0603; 外壳代码 - mm: 1608; 产品种类: Low & Medium Capacitance SMD Ceramic Chip Capacitors; 标准包装数量: 4000; Supplier 1: Mouser; Supplier Part Number 1: 810-C1608X7R1H104K; Manufacturer Part Number: C1608X7R1H104K; RoHS: RoHS Compliant; Description 1: 多层陶瓷电容器MLCC - SMD/SMT 0603 0.1uF 50volts X7R 10%; Category: 多层陶瓷电容器MLCC - SMD/SMT; Stock 1: 224604; Pricing 1: 1=0.160, 50=0.070, 100=0.036, 500=0.019, 1000=0.013, 4000=0.010, 8000=0.009, 12000=0.008, 20000=0.007 (USD); 端接类型: SMD/SMT; 容差: 10 %; 制造商: TDK; 温度系数/代码: X7R; RoHS - 贸泽: Y; Minimum Order Quantity: 1; Reeling: True; ComponentLink1URL: http://www.tdk.com/pdf/general_B11.pdf; ComponentLink1Description: http://www.tdk.com/pdf/general_B11.pdf
  C45: 电容: 0.1 uF
C46 C47 = CAP: as C42 on sheet 03-GPS; Category: 多层陶瓷电容器MLCC - SMD/SMT; ComponentLink1Description: http://www.tdk.com/pdf/general_B11.pdf; ComponentLink1URL: http://www.tdk.com/pdf/general_B11.pdf; Description 1: 多层陶瓷电容器MLCC - SMD/SMT 0603 0.1uF 50volts X7R 10%; Manufacturer Part Number: C1608X7R1H104K; Minimum Order Quantity: 1; Pricing 1: 1=0.160, 50=0.070, 100=0.036, 500=0.019, 1000=0.013, 4000=0.010, 8000=0.009, 12000=0.008, 20000=0.007 (USD); Reeling: True; RoHS - 贸泽: Y; RoHS: RoHS Compliant; Stock 1: 224604; Supplier 1: Mouser; Supplier Part Number 1: 810-C1608X7R1H104K; 制造商: TDK; 容差: 10 %; 温度系数/代码: X7R; 电容: 0.1 uF; 端接类型: SMD/SMT
LRN1 = Res Semi: as LR4 on sheet 03-GPS; Supplier 1: Mouser; Supplier Part Number 1: 810-MPZ2012S221A; Manufacturer Part Number: MPZ2012S221A; RoHS: RoHS Compliant; Description 1: 电磁干扰滤波珠子、扼流圈和阵列 Ferrite Chip Beads; Category: 电磁干扰滤波珠子、扼流圈和阵列; Stock 1: 26540; Pricing 1: 1=0.070, 50=0.060, 100=0.053, 500=0.040, 1000=0.035, 4000=0.031, 8000=0.029, 12000=0.025 (USD); 制造商: TDK; RoHS - 贸泽: Y; Minimum Order Quantity: 1; Reeling: True; ComponentLink1URL: http://www.mouser.com/ds/2/400/e9413_mpz-24582.pdf; ComponentLink1Description: http://www.mouser.com/ds/2/400/e9413_mpz-24582.pdf
R48 R51 RN6-RN8 = RES: as R36 on sheet 03-GPS; Supplier 1: Mouser; Supplier Part Number 1: 71-CRCW0603-10K-E3; Manufacturer Part Number: CRCW060310K0FKEA; RoHS: RoHS Compliant By Exemption; Category: 厚膜电阻器 - SMD; Stock 1: 0; Pricing 1: 1=0.080, 10=0.013, 100=0.010, 1000=0.008, 5000=0.005, 25000=0.004, 50000=0.003 (USD); 电阻: 10 kOhms; 容差: 1 %; RoHS - 贸泽: E; Minimum Order Quantity: 1; Reeling: True; ComponentLink1URL: http://www.mouser.com/ds/2/427/dcrcwe3-109170.pdf; ComponentLink1Description: http://www.mouser.com/ds/2/427/dcrcwe3-109170.pdf; Description 1: 厚膜电阻器 - SMD 1/10watt 10Kohms 1%
R49 = RES: as R38 on sheet 03-GPS; Supplier 1: Mouser; Supplier Part Number 1: 71-CRCW0603-100K-E3; Manufacturer Part Number: CRCW0603100KFKEA; RoHS: RoHS Compliant By Exemption; Category: 厚膜电阻器 - SMD; Stock 1: 175756; Pricing 1: 1=0.080, 10=0.013, 100=0.010, 1000=0.008, 5000=0.005, 25000=0.004, 50000=0.003 (USD); 电阻: 100 kOhms; 容差: 1 %; RoHS - 贸泽: E; Minimum Order Quantity: 1; Reeling: True; ComponentLink1URL: http://www.mouser.com/ds/2/427/dcrcwe3-109170.pdf; ComponentLink1Description: http://www.mouser.com/ds/2/427/dcrcwe3-109170.pdf; Description 1: 厚膜电阻器 - SMD 1/10watt 100Kohms 1%
R50 R54 = RES: 厚膜电阻器 - SMD 1/10watt 1.0Mohms 1%; Manufacturer: Vishay / Dale; 尺寸: 0.85 mm W x 1.55 mm L x 0.45 mm H; 工作温度范围: - 55 C to + 155 C; 封装 / 箱体: 0603 (1608 metric); 封装: Reel; 功率额定值: 100 mW; 产品: Thick Film Resistors SMD; 电阻: 1 MOhms; 系列: CRCW; 温度系数: 100 PPM / K; 端接类型: SMD/SMT; 电压额定值: 75 V; 外壳代码 - in: 0603; 外壳代码 - mm: 1608; 制造商: Vishay; 产品种类: 0603 Thick Film Chip Resistors; 标准包装数量: 5000; Supplier 1: Mouser; Supplier Part Number 1: 71-CRCW0603-1.0M-E3; Manufacturer Part Number: CRCW06031M00FKEA; RoHS: RoHS Compliant By Exemption; Category: 厚膜电阻器 - SMD; Stock 1: 71394; Pricing 1: 1=0.080, 10=0.013, 100=0.010, 1000=0.008, 5000=0.005, 25000=0.004, 50000=0.003 (USD); 容差: 1 %; RoHS - 贸泽: E; Minimum Order Quantity: 1; Reeling: True; ComponentLink1URL: http://www.mouser.com/ds/2/427/dcrcwe3-109170.pdf; ComponentLink1Description: http://www.mouser.com/ds/2/427/dcrcwe3-109170.pdf; Description 1: 厚膜电阻器 - SMD 1/10watt 1.0Mohms 1%
R52 R53 R55 = RES: as R39 on sheet 03-GPS; Supplier 1: Mouser; Supplier Part Number 1: 71-CRCW0603-1.0K-E3; Manufacturer Part Number: CRCW06031K00FKEA; RoHS: RoHS Compliant By Exemption; Category: 厚膜电阻器 - SMD; Stock 1: 276938; Pricing 1: 1=0.080, 10=0.013, 100=0.010, 1000=0.008, 5000=0.005, 25000=0.004, 50000=0.003 (USD); 容差: 1 %; RoHS - 贸泽: E; Minimum Order Quantity: 1; Reeling: True; ComponentLink1URL: http://www.mouser.com/ds/2/427/dcrcwe3-109170.pdf; ComponentLink1Description: http://www.mouser.com/ds/2/427/dcrcwe3-109170.pdf; Description 1: 厚膜电阻器 - SMD 1/10watt 1.0Kohms 1%
TP4 = Test Point
U8 = BQ24073: 电池管理 1.5A USB-Friendly Li Ion Batt Charger; Manufacturer: Texas Instruments; Manufacturer Part Number: BQ24075TRGTT; 输出电流: 5 A; 输出电压: 5.5 V; 封装 / 箱体: QFN-16; 封装: Reel; 系列: BQ24075T; 电荷安全定时器: Yes; 安装风格: SMD/SMT; 电池类型: Li-Ion; 最大功率耗散: 2.3 W; 工作电源电流: 1.5 mA; 工作电源电压: 4.35 V to 26 V; 产品种类: Battery Management; 产品类型: Charge Management; 标准包装数量: 250; Supplier 1: Mouser; Supplier Part Number 1: 595-BQ24075TRGTT; RoHS: RoHS Compliant; Description 1: 电池管理 1.5A USB-Friendly Li Ion Batt Charger; Category: 电池管理; Stock 1: 641; Pricing 1: 1=2.60, 10=2.33, 25=2.08, 50=1.96, 100=1.40, 250=1.37, 500=1.35, 750=1.32, 1000=1.30 (USD); 温度监测: Yes; 制造商: Texas Instruments; RoHS - 贸泽: Y; Minimum Order Quantity: 1; Reeling: True; ComponentLink1URL: http://www.mouser.com/ds/2/405/slus937a-120341.pdf; ComponentLink1Description: http://www.mouser.com/ds/2/405/slus937a-120341.pdf

## Sheet 开盒检测_MAX931.SchDoc
size A4; DocumentNumber: 33; SheetNumber: 33; SheetTotal: 34
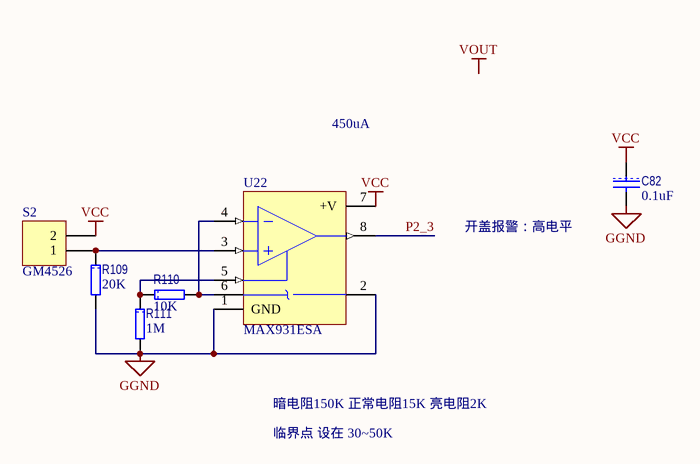
[diagram p21: 开盒检测_MAX931.SchDoc]

### Parts
C82  value 0.1uF  [1608[0603]C]  (hidden comment: C1608X7R1H104K)
R109  value 20K  [1608[0603]R]  (hidden comment: CRCW060315K0FKEA)
R110  value 10K  [1608[0603]R]  (hidden comment: CRCW060310K0FKEA)
R111  value 1M  [1608[0603]R]  (hidden comment: CRCW060310K0FKEA)
S2  GM4526  [GM4526]
U22  MAX931ESA  [NSO8_N]

### Nets
GGND: C82.2 R109.2 R111.2 U22.1(GND) U22.2(-V)
VCC: C82.1 S2.2 U22.7(+V)
P2_3: U22.8(OUT)
NetR109_1: R109.1 S2.1 U22.3(IN+)
NetR110_1: R110.1 R111.1 U22.5(HYST)
NetR110_2: R110.2 U22.4(IN-) U22.6(REF)

### Notes on the sheet
- 450uA
- 开盖报警：高电平
- 暗电阻150K 正常电阻15K 亮电阻2K
- 临界点 设在 30~50K
- Labels drawn without touching a wire or pin: VOUT

### Library data of the parts
C82 = CAP: as C42 on sheet 03-GPS; Category: 多层陶瓷电容器MLCC - SMD/SMT; ComponentLink1Description: http://www.tdk.com/pdf/general_B11.pdf; ComponentLink1URL: http://www.tdk.com/pdf/general_B11.pdf; Description 1: 多层陶瓷电容器MLCC - SMD/SMT 0603 0.1uF 50volts X7R 10%; Manufacturer Part Number: C1608X7R1H104K; Minimum Order Quantity: 1; Pricing 1: 1=0.160, 50=0.070, 100=0.036, 500=0.019, 1000=0.013, 4000=0.010, 8000=0.009, 12000=0.008, 20000=0.007 (USD); Reeling: True; RoHS - 贸泽: Y; RoHS: RoHS Compliant; Stock 1: 224604; Supplier 1: Mouser; Supplier Part Number 1: 810-C1608X7R1H104K; 制造商: TDK; 容差: 10 %; 温度系数/代码: X7R; 电容: 0.1 uF; 端接类型: SMD/SMT
R109 = RES: 厚膜电阻器 - SMD 1/10watt 15Kohms 1%
R110 R111 = RES: as R36 on sheet 03-GPS; Supplier 1: Mouser; Supplier Part Number 1: 71-CRCW0603-10K-E3; Manufacturer Part Number: CRCW060310K0FKEA; RoHS: RoHS Compliant By Exemption; Category: 厚膜电阻器 - SMD; Stock 1: 0; Pricing 1: 1=0.080, 10=0.013, 100=0.010, 1000=0.008, 5000=0.005, 25000=0.004, 50000=0.003 (USD); 电阻: 10 kOhms; 容差: 1 %; RoHS - 贸泽: E; Minimum Order Quantity: 1; Reeling: True; ComponentLink1URL: http://www.mouser.com/ds/2/427/dcrcwe3-109170.pdf; ComponentLink1Description: http://www.mouser.com/ds/2/427/dcrcwe3-109170.pdf; Description 1: 厚膜电阻器 - SMD 1/10watt 10Kohms 1%
S2 = Header 2: 插针 光敏传感器; 公司: 百灵电子; LatestRevisionDate: 17-Jul-2002; LatestRevisionNote: Re-released for DXP Platform.; Publisher: Altium Limited
U22 = MAX931ESA: Ultra Low-Power, Low-Cost Comparator with 2% Reference; Published: 16-Jan-2001; LatestRevisionDate: 13-Apr-2006; LatestRevisionNote: IPC-7351 Footprint Added.; DatasheetVersion: Feb-1997; PackageReference: NSO8; Publisher: Altium Limited; PackageDescription: 8-Pin Small Outline Integrated Circuit 1.27 mm Pitch; Code_JEDEC: MS-012-AA; Code_IPC: SOIC127P600-8; ComponentLink1Description: Manufacturer Link; ComponentLink1URL: http://www.maxim-ic.com/; ComponentLink2Description: Datasheet; ComponentLink2URL: http://pdfserv.maxim-ic.com/en/ds/MAX931-MAX934.pdf